# EasyEDA schematic easyeda.json
TITLE: Sheet_1; REV: 1.0; Date: 2025-03-24; Sheet: 1/1; Drawn By: progzone122; Company: Your Company
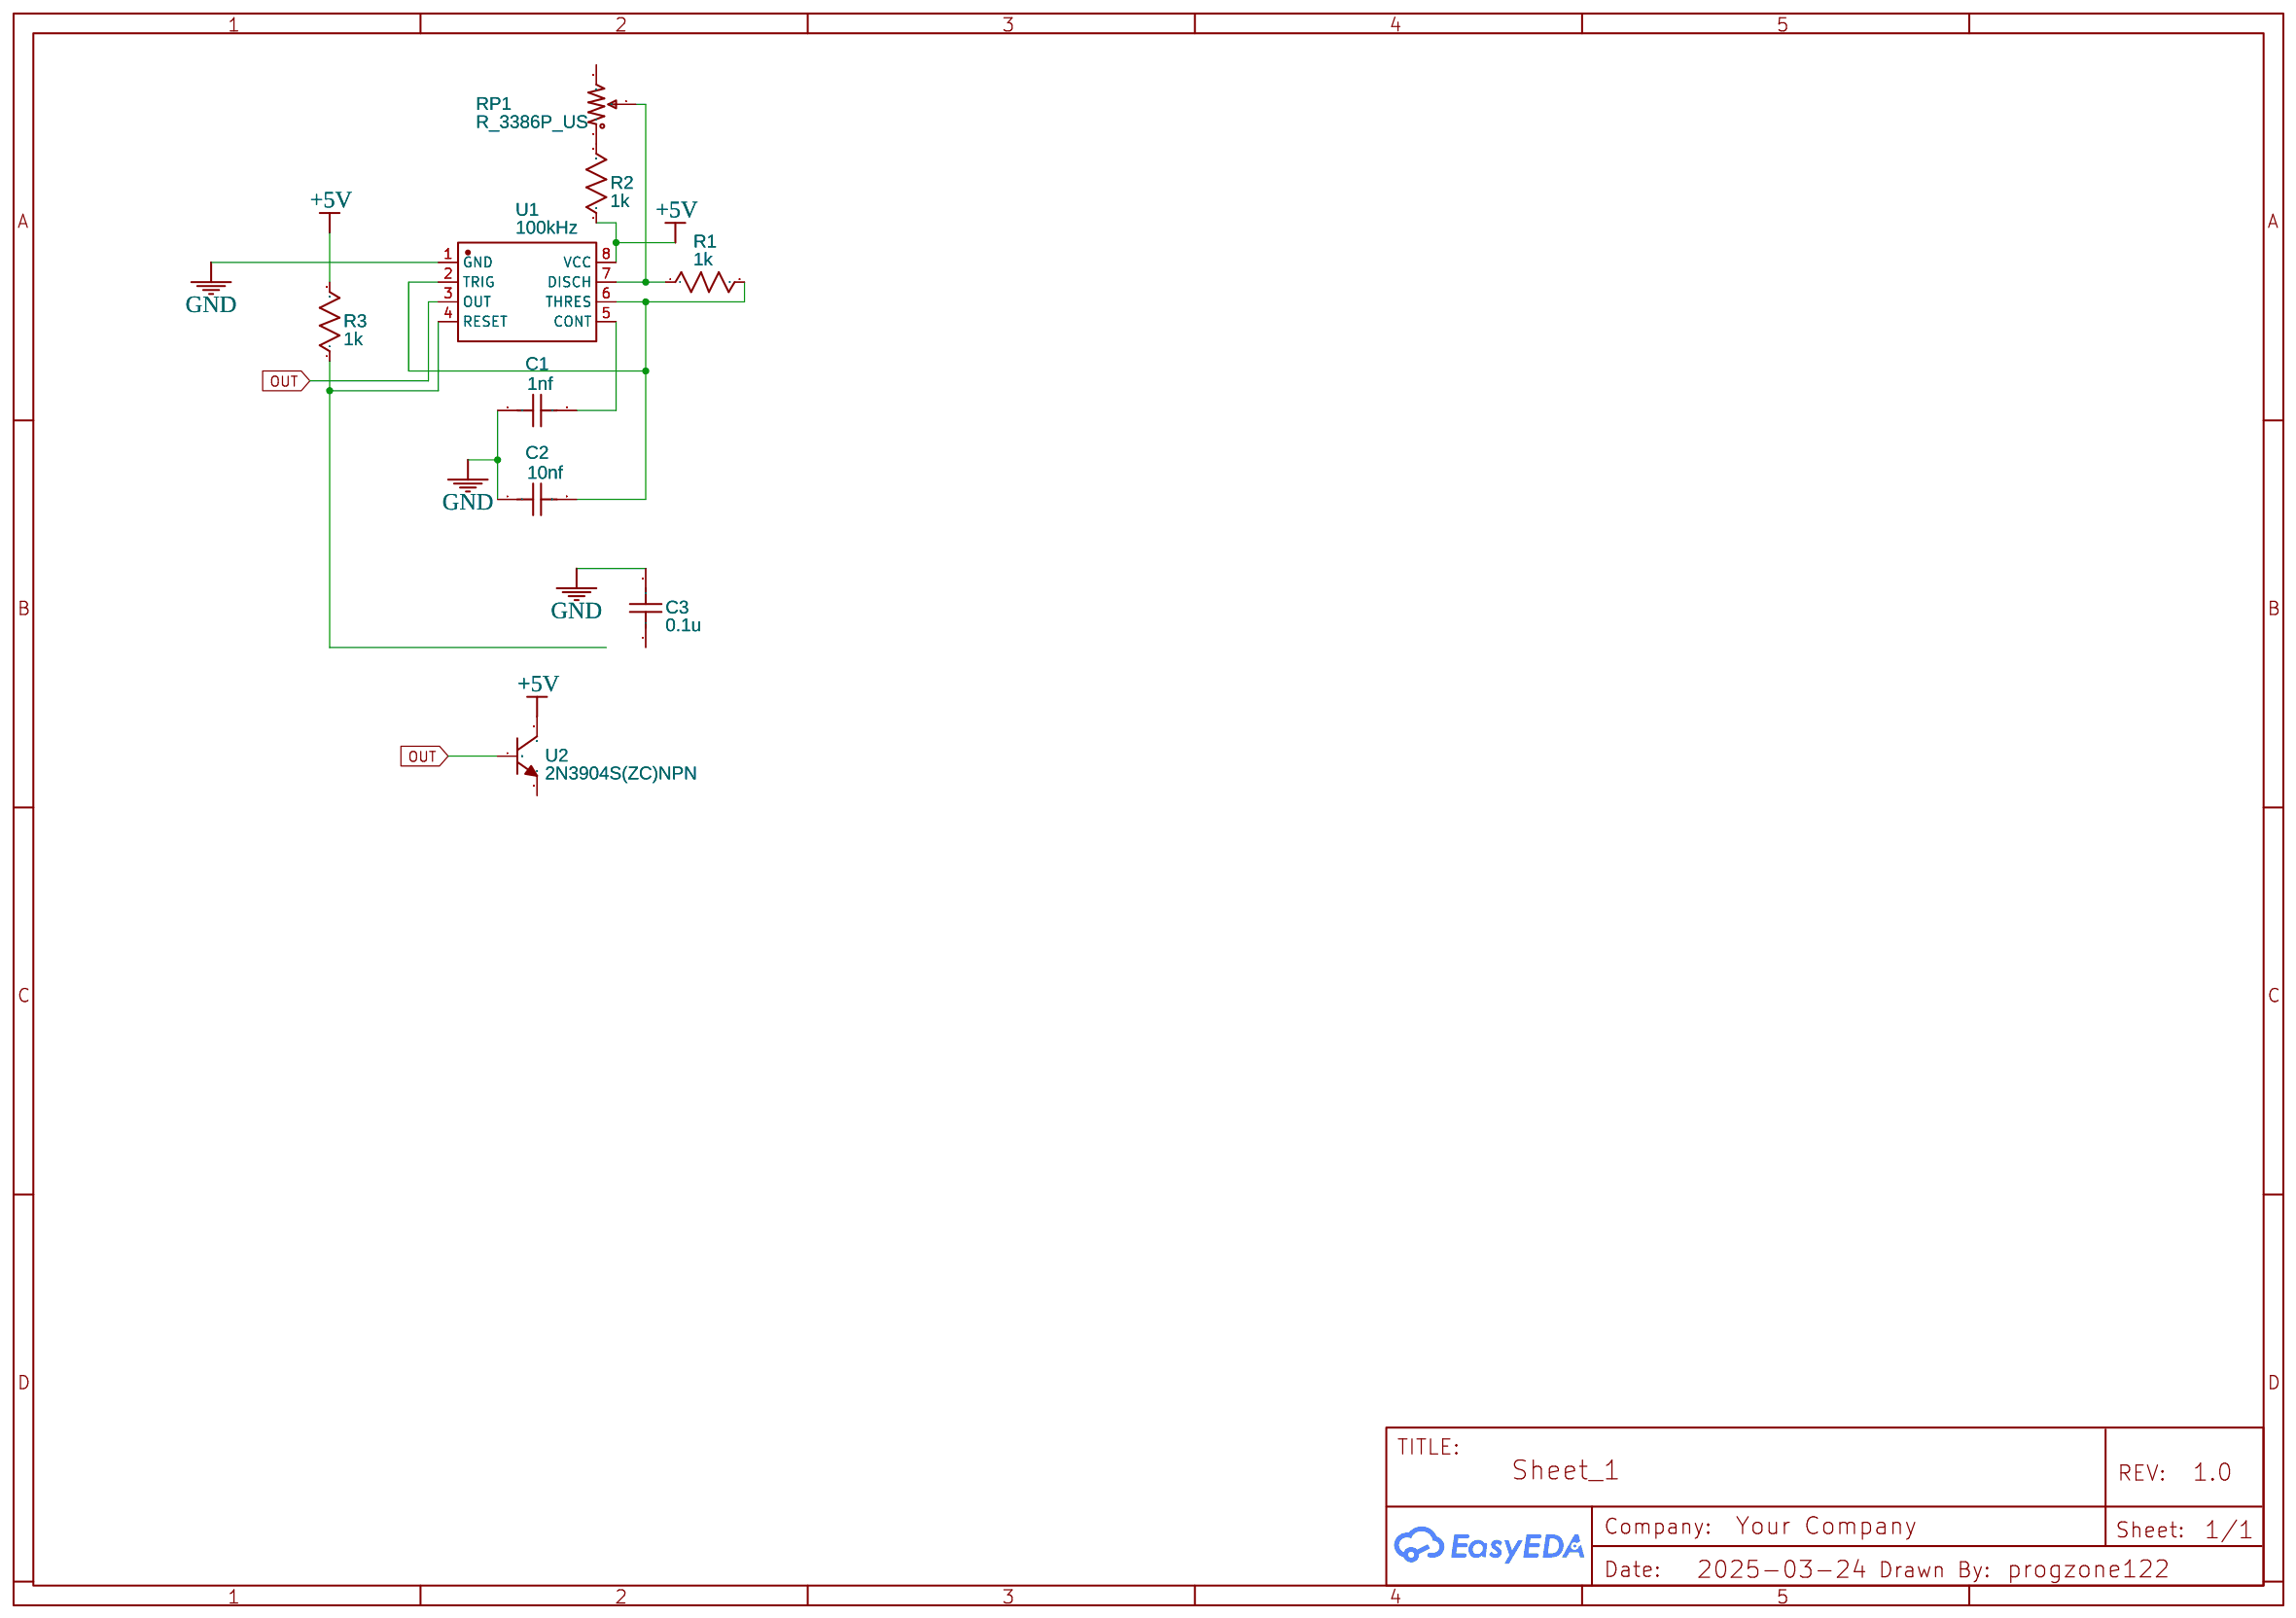
[diagram p0: schematic sheet]

## Parts
C1  1nf  [C0603]
C2  10nf  [C0603]
C3  0.1u  [C0603]
R1  1k  [R0603]
R2  1k  [R0603]
R3  1k  [R0603]
RP1  R_3386P_US  [RES-ADJ-TH_3386P]
U1  100kHz  [DIP-8_L9.8-W6.6-P2.54-LS7.6-BL]
U2  2N3904S(ZC)NPN  [SOT-23-3_L2.9-W1.3-P0.95-LS2.4-BR]

## Library data of the parts
C1-C3 = C_0603_US: Contributor: LCEDA_Lib
R1-R3 = R_0603_US: Contributor: LCEDA_Lib
RP1 = R_3386P_US: Supplier: LCSC; Contributor: LCEDA_Lib; value(Ω): 10K
U1 = NE555P: Supplier: LCSC; Manufacturer: TI(德州仪器); Supplier Part: C46749; JLCPCB Part Class: Extended Part
U2 = 2N3904S(ZC)NPN: Contributor: lcsc; Supplier: LCSC; Supplier Part: C9900013034; Manufacturer: null; JLCPCB Part Class: Extended Part

## Nets
+5V: R2.1 R3.2 U1.8(VCC) U2.3(C)
GND: C1.1 C2.1 C3.2 U1.1(GND)
OUT: U1.3(OUT) U2.1(B)
Net-(C1-2): C1.2 U1.5(CONT)
Net-(C2-2): C2.2 R1.2 U1.2(TRIG) U1.6(THRES)
Net-(R1-1): R1.1 RP1.2 U1.7(DISCH)
Net-(R2-2): R2.2 RP1.1
Net-(R3-1): R3.1 U1.4(RESET)

Not connected (* = marked no-connect by the designer): C3 1; RP1 3; U2 2(E)
